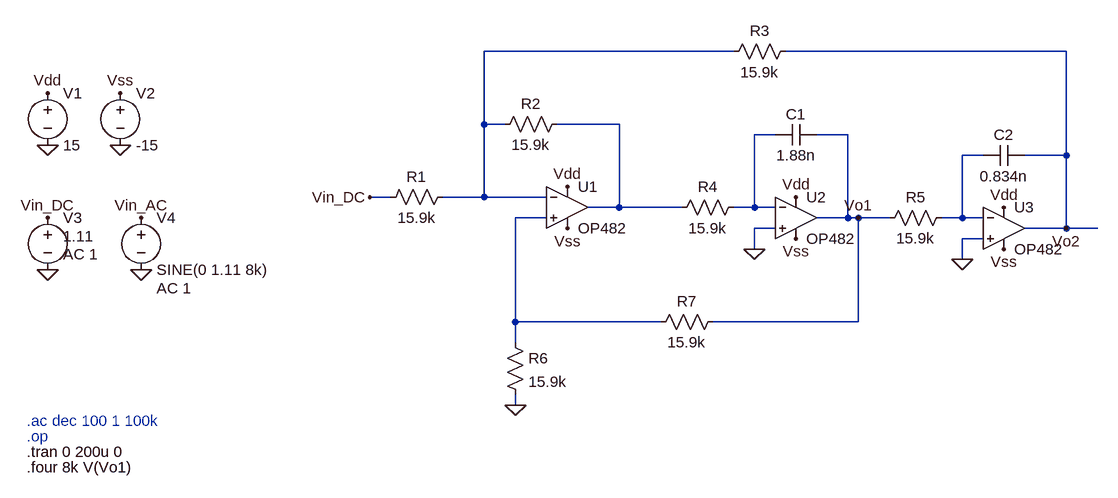
[diagram p0: schematic Et_2_PROIECT.asc]
Et_2_PROIECT.asc, the LTspice schematic file:
Version 4
SHEET 1 1256 680
WIRE 640 -160 256 -160
WIRE 1152 -160 720 -160
WIRE 256 -48 256 -160
WIRE 288 -48 256 -48
WIRE 464 -48 368 -48
WIRE 704 -32 672 -32
WIRE 816 -32 768 -32
WIRE 1024 0 992 0
WIRE 1152 0 1152 -160
WIRE 1152 0 1088 0
WIRE 112 64 80 64
WIRE 256 64 256 -48
WIRE 256 64 192 64
WIRE 352 64 256 64
WIRE 464 80 464 -48
WIRE 464 80 416 80
WIRE 560 80 464 80
WIRE 672 80 672 -32
WIRE 672 80 640 80
WIRE 704 80 672 80
WIRE 352 96 304 96
WIRE 816 96 816 -32
WIRE 816 96 768 96
WIRE 832 96 816 96
WIRE 880 96 832 96
WIRE 992 96 992 0
WIRE 992 96 960 96
WIRE 1024 96 992 96
WIRE 704 112 672 112
WIRE 1152 112 1152 0
WIRE 1152 112 1088 112
WIRE 1200 112 1152 112
WIRE 1024 128 992 128
WIRE 672 144 672 112
WIRE 992 160 992 128
WIRE 304 256 304 96
WIRE 528 256 304 256
WIRE 832 256 832 96
WIRE 832 256 608 256
WIRE 304 288 304 256
WIRE 304 384 304 368
FLAG 992 160 0
FLAG 672 144 0
FLAG 304 384 0
FLAG 80 64 Vin_DC
FLAG -416 -16 0
FLAG -304 -16 0
FLAG -416 -96 Vdd
FLAG -304 -96 Vss
FLAG 384 48 Vdd
FLAG 736 64 Vdd
FLAG 1056 80 Vdd
FLAG 384 112 Vss
FLAG 736 128 Vss
FLAG 1056 144 Vss
FLAG -416 176 0
FLAG -416 96 Vin_DC
FLAG -272 176 0
FLAG -272 96 Vin_AC
FLAG 832 96 Vo1
FLAG 1152 112 Vo2
SYMBOL OpAmps\\OP482 384 16 R0
SYMATTR InstName U1
SYMBOL OpAmps\\OP482 736 32 R0
SYMATTR InstName U2
SYMBOL OpAmps\\OP482 1056 48 R0
SYMATTR InstName U3
SYMBOL res 976 80 R90
WINDOW 0 0 56 VBottom 2
WINDOW 3 32 56 VTop 2
SYMATTR InstName R5
SYMATTR Value 15.9k
SYMBOL cap 768 -48 R90
WINDOW 0 0 32 VBottom 2
WINDOW 3 32 32 VTop 2
SYMATTR InstName C1
SYMATTR Value 1.88n
SYMBOL res 656 64 R90
WINDOW 0 0 56 VBottom 2
WINDOW 3 32 56 VTop 2
SYMATTR InstName R4
SYMATTR Value 15.9k
SYMBOL res 624 240 R90
WINDOW 0 0 56 VBottom 2
WINDOW 3 32 56 VTop 2
SYMATTR InstName R7
SYMATTR Value 15.9k
SYMBOL res 288 272 R0
SYMATTR InstName R6
SYMATTR Value 15.9k
SYMBOL res 384 -64 R90
WINDOW 0 0 56 VBottom 2
WINDOW 3 32 56 VTop 2
SYMATTR InstName R2
SYMATTR Value 15.9k
SYMBOL res 208 48 R90
WINDOW 0 0 56 VBottom 2
WINDOW 3 32 56 VTop 2
SYMATTR InstName R1
SYMATTR Value 15.9k
SYMBOL res 736 -176 R90
WINDOW 0 0 56 VBottom 2
WINDOW 3 32 56 VTop 2
SYMATTR InstName R3
SYMATTR Value 15.9k
SYMBOL voltage -416 -112 R0
WINDOW 123 0 0 Left 0
WINDOW 39 0 0 Left 0
SYMATTR InstName V1
SYMATTR Value 15
SYMBOL voltage -304 -112 R0
WINDOW 123 0 0 Left 0
WINDOW 39 0 0 Left 0
SYMATTR InstName V2
SYMATTR Value -15
SYMBOL cap 1088 -16 R90
WINDOW 0 0 32 VBottom 2
WINDOW 3 32 32 VTop 2
SYMATTR InstName C2
SYMATTR Value 0.834n
SYMBOL voltage -416 80 R0
WINDOW 3 24 44 Left 2
WINDOW 123 24 72 Left 2
WINDOW 39 0 0 Left 0
SYMATTR Value 1.11
SYMATTR Value2 AC 1
SYMATTR InstName V3
SYMBOL voltage -272 80 R0
WINDOW 123 24 124 Left 2
WINDOW 39 0 0 Left 0
SYMATTR Value2 AC 1
SYMATTR InstName V4
SYMATTR Value SINE(0 1.11 8k)
TEXT -448 408 Left 2 ;.ac dec 100 1 100k
TEXT -448 432 Left 2 ;.op
TEXT -448 456 Left 2 !.tran 0 200u 0
TEXT -448 480 Left 2 !.four 8k V(Vo1)

The netlist it stands for:
* Et_2_PROIECT.asc
XU1 N005 N001 Vdd Vss N002 OP482  ; pins In+ In- V+ V- OUT
XU2 0 N003 Vdd Vss Vo1 OP482  ; pins In+ In- V+ V- OUT
XU3 0 N004 Vdd Vss Vo2 OP482  ; pins In+ In- V+ V- OUT
R5 N004 Vo1 15.9k
C1 Vo1 N003 1.88n
R4 N003 N002 15.9k
R7 Vo1 N005 15.9k
R6 N005 0 15.9k
R2 N002 N001 15.9k
R1 N001 Vin_DC 15.9k
R3 Vo2 N001 15.9k
V1 Vdd 0 15
V2 Vss 0 -15
C2 Vo2 N004 0.834n
V3 Vin_DC 0 1.11 AC 1
V4 Vin_AC 0 SINE(0 1.11 8k) AC 1
* .ac dec 100 1 100k
* .op
.tran 0 200u 0
.four 8k V(Vo1)
.backanno
.end